# Altium schematic sheet Schematic_MicroBot Voltage Regulator V1.schdoc
size 238 x 174 mm
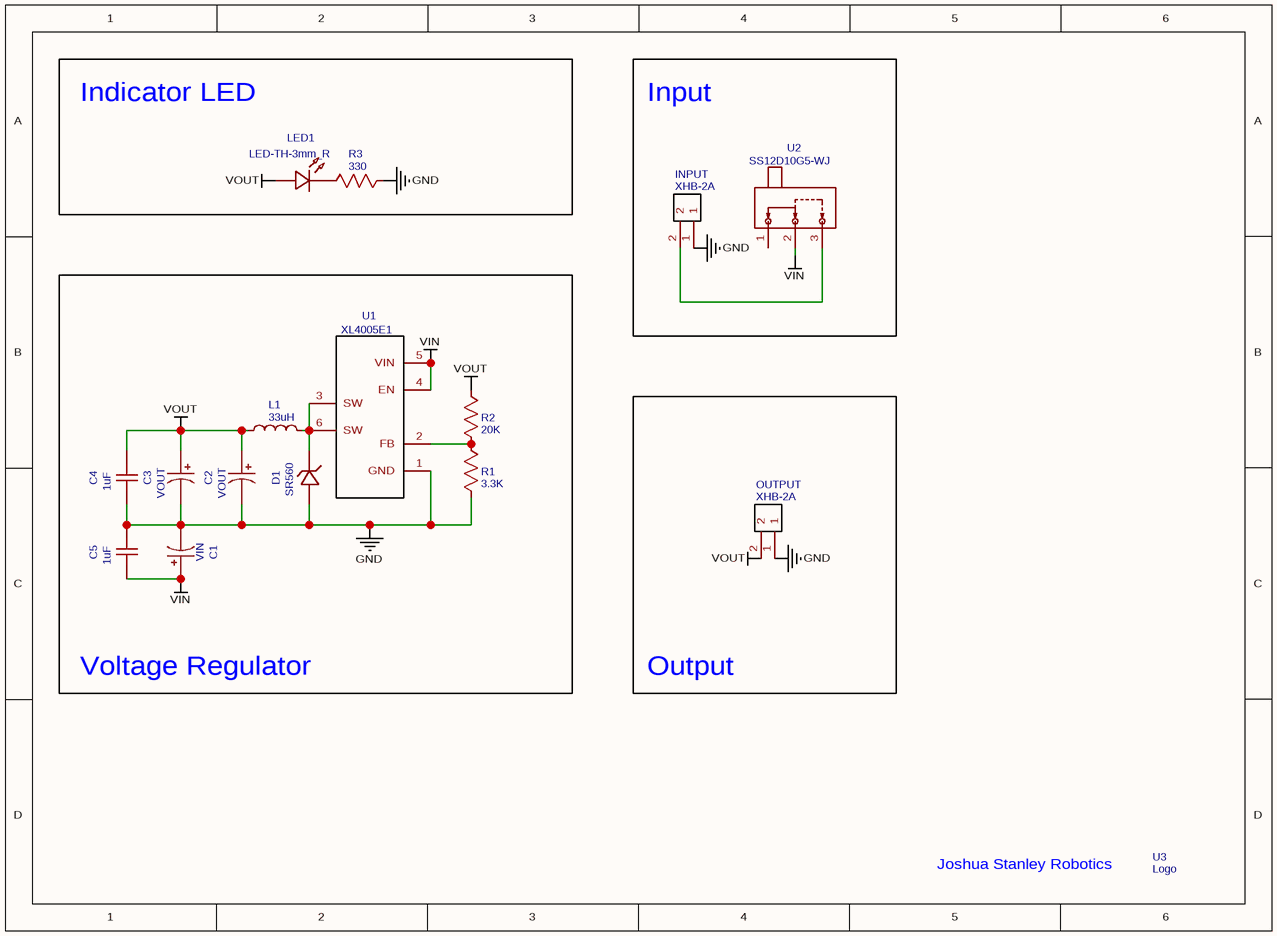
[diagram p0: Schematic_MicroBot Voltage Regulator V1.schdoc]

## Parts
C1  VIN  [CAP-D8.0×F3.5]
C2  VOUT  [CAP-D8.0×F3.5]
C3  VOUT  [CAP-D8.0×F3.5]
C4  1uF  [CERAMIC CAPACITOR]
C5  1uF  [CERAMIC CAPACITOR]
D1  SR560  [DO-27_BD5.3-L8.4-P12.40-D1.3-R-RD]
INPUT  XHB-2A  [CONN-TH_XHB-2A]
L1  33uH  [IND-SMD_L12.3-W12.3]
LED1  LED-TH-3mm_R  [LED-TH_BD3.0_RED]
OUTPUT  XHB-2A  [CONN-TH_XHB-2A]
R1  3.3K  [1/4W RESISTOR]
R2  20K  [1/4W RESISTOR]
R3  330  [1/4W RESISTOR]
U1  XL4005E1  [TO-263-5_L10.2-W9.2-P1.70-TL]
U2  SS12D10G5-WJ  [SW-TH_3P-SS12D06-1]
U3  Logo  [LOGO]

## Blocks framed on the sheet
Indicator LED: LED1 R3
Input: INPUT U2
Voltage Regulator: C1-C5 D1 L1 R1 R2 U1
Output: OUTPUT

## Nets
GND: C1.2 C2.2 C3.2 C4.2 C5.1 D1.1(A) INPUT.1 OUTPUT.1 R1.2 R3.2 U1.1(GND)
VIN: C1.1 C5.2 U1.4(EN) U1.5(VIN) U2.2
VOUT: C2.1 C3.1 C4.1 L1.1 LED1.1 OUTPUT.2 R2.1
NetD1_2: D1.2(C) L1.2 U1.3(SW) U1.6(SW)
NetINPUT_2: INPUT.2 U2.3
NetLED1_2: LED1.2 R3.1
NetR1_1: R1.1 R2.2 U1.2(FB)

Not connected (* = marked no-connect by the designer): U2 1

## Notes on the sheet
- (in symbol Logo) Joshua Stanley Robotics

## Library data of the parts
C1 = VIN: nameAlias: Value(F); Contributor: LCEDA_Lib; spicePre: C; spiceSymbolName: CE_TH_D8.0×F3.5_US
C2 C3 = VOUT: nameAlias: Value(F); Contributor: LCEDA_Lib; spicePre: C; spiceSymbolName: CE_TH_D8.0×F3.5_US
C4 C5 = 1uF: nameAlias: Value(F); Contributor: LCEDA_Lib; spicePre: C; spiceSymbolName: C_RAD-0.2_US
D1 = SR560: Manufacturer: LGE(鲁光); Contributor: LCSC; Supplier: LCSC; Supplier Part: C402301; Manufacturer Part: SR560; JLCPCB Part Class: Extended Part; spicePre: D; spiceSymbolName: SR560_C402301
INPUT OUTPUT = XHB-2A: Manufacturer: BOOMELE(博穆精密); Supplier: LCSC; Manufacturer Part: XHB-2A; Supplier Part: C57981; JLCPCB Part Class: Extended Part; spicePre: C; spiceSymbolName: XHB-2A Connector
L1 = 33uH: Manufacturer: SHOU HAN(首韩); Manufacturer Part: CYH127-33UH; nameAlias: Value; Contributor: LCSC; Supplier: LCSC; Supplier Part: C2929502; JLCPCB Part Class: Extended Part; spicePre: L; spiceSymbolName: CYH127-33UH
LED1 = LED-TH-3mm_R: Manufacturer: EVERLIGHT(台湾亿光); Manufacturer Part: 204-10SDRD/S530-A3-L; Contributor: LCEDA_Lib; Supplier Part: C84774; Supplier: LCSC; spicePre: L; spiceSymbolName: LED-TH-3mm_R
R1 = 3.3K: nameAlias: Value(Ω); Contributor: LCEDA_Lib; spicePre: R; spiceSymbolName: R_AXIAL-0.3_US
R2 = 20K: nameAlias: Value(Ω); Contributor: LCEDA_Lib; spicePre: R; spiceSymbolName: R_AXIAL-0.3_US
R3 = 330: nameAlias: Value(Ω); Contributor: LCEDA_Lib; spicePre: R; spiceSymbolName: R_AXIAL-0.3_US
U1 = XL4005E1: Manufacturer: XLSEMI(芯龙); Supplier: LCSC; Manufacturer Part: XL4005E1; Supplier Part: C73332; JLCPCB Part Class: Extended Part; spicePre: U; spiceSymbolName: XL4005E1
U2 = SS12D10G5-WJ: Manufacturer: SHOU HAN(首韩); Contributor: lcsc; Supplier: LCSC; Supplier Part: C7431058; Manufacturer Part: SS12D10G5-WJ; JLCPCB Part Class: Extended Part; spicePre: U; spiceSymbolName: SS12D10G5-WJ
U3 = Logo: Contributor: jstan3546; spicePre: U; spiceSymbolName: Logo